# EAGLE schematic schematic_r2 (EAGLE 7.4.0)
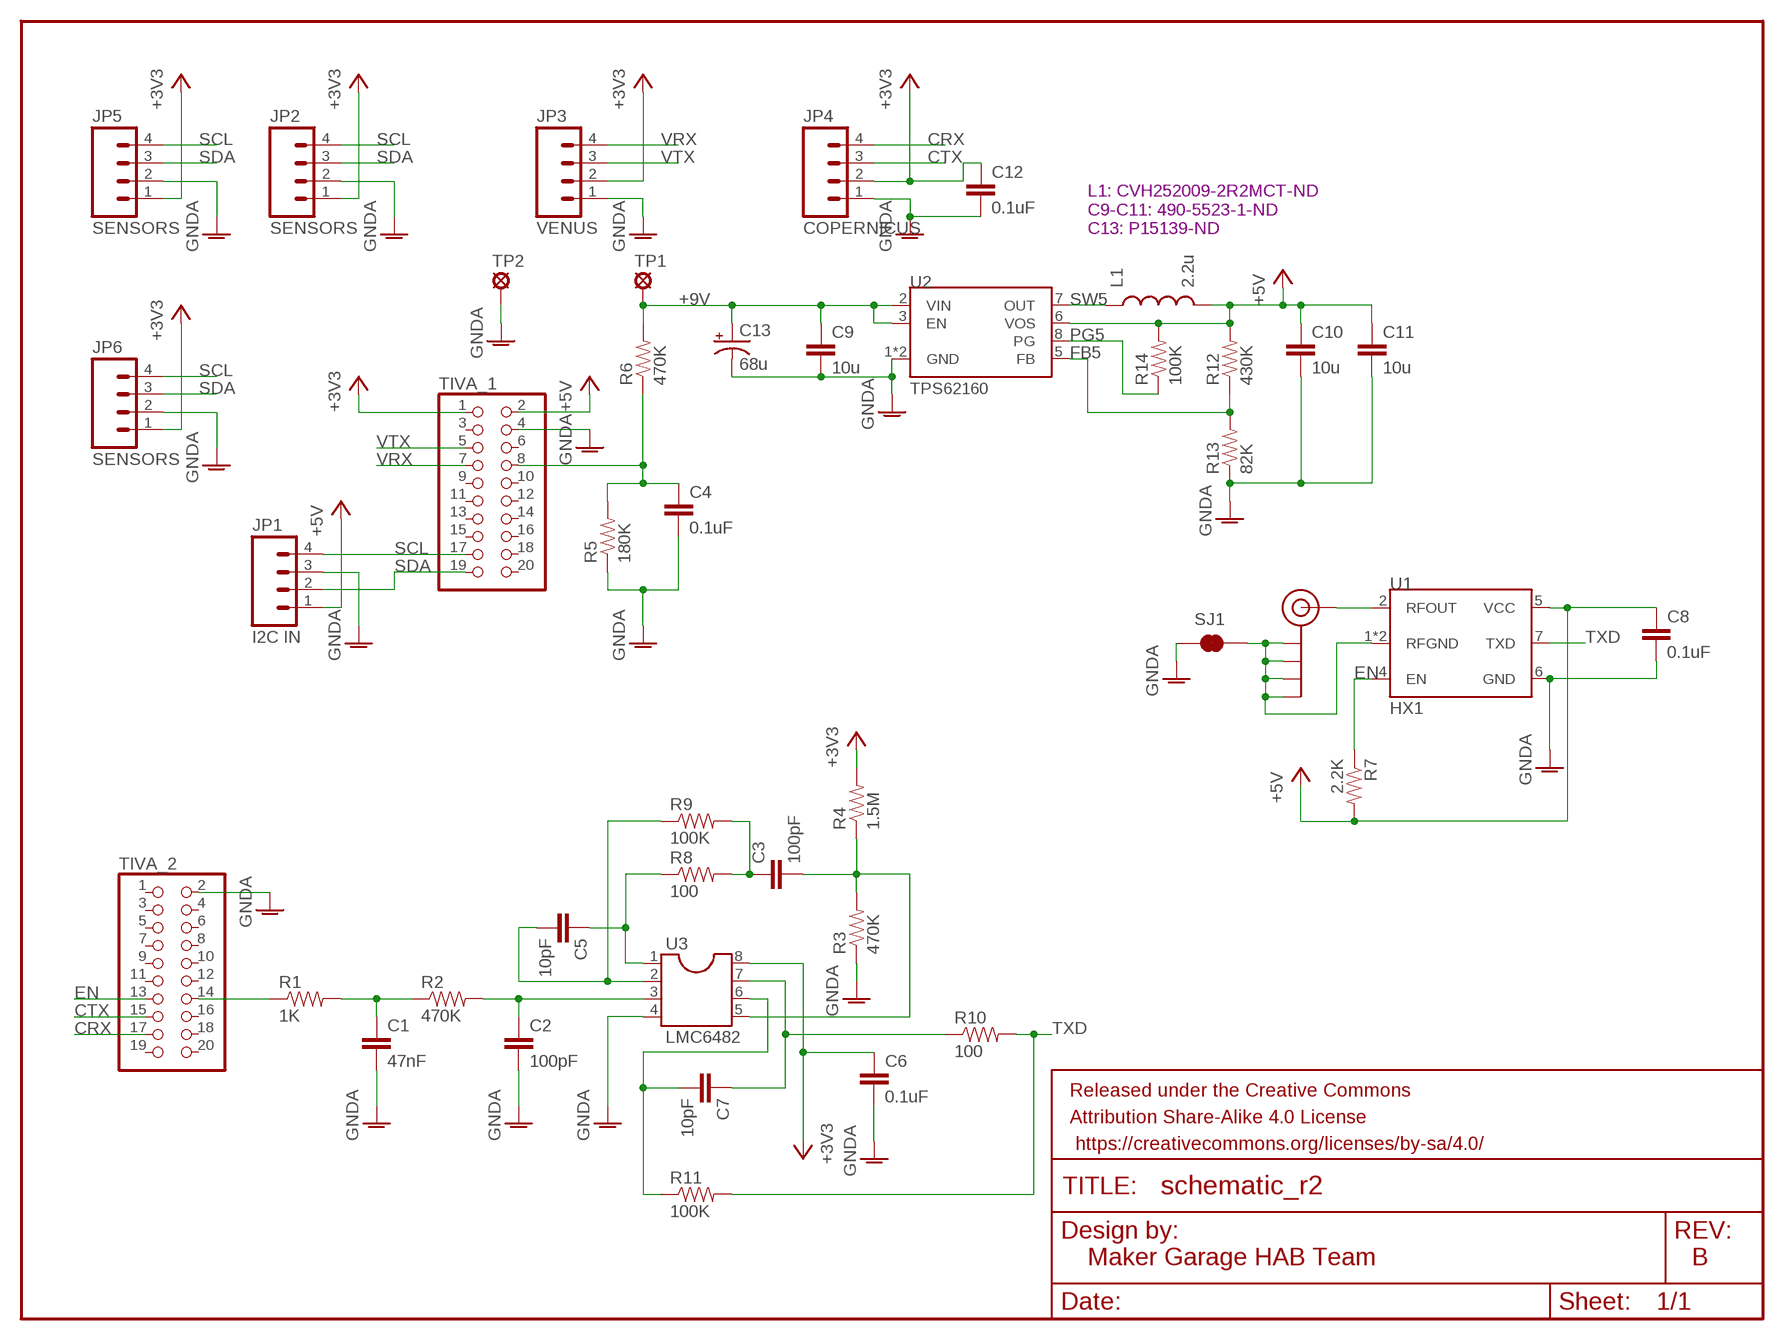
[diagram p0: schematic, sheet 1]

## Parts
C1  47nF  CAP0805  [0805]
C2  100pF  CAP0805  [0805]
C3  100pF  CAP0805  [0805]
C4  0.1uF  CAP0805  [0805]
C5  10pF  CAP0805  [0805]
C6  0.1uF  CAP0805  [0805]
C7  10pF  CAP0805  [0805]
C8  0.1uF  CAP0805  [0805]
C9  10u  CAP0805  [0805]
C10  10u  CAP0805  [0805]
C11  10u  CAP0805  [0805]
C12  0.1uF  CAP0805  [0805]
C13  68u  CAP_POLPTH2  [CPOL-RADIAL-10UF-25V]
FRAME1  FRAME-LETTERNO_PACKAGE  [DUMMY]
J1  SMA_EDGE  [SMA-EDGE]
JP1  I2C IN  M04PTH  [1X04]
JP2  SENSORS  M04PTH  [1X04]
JP3  VENUS  M04PTH  [1X04]
JP4  COPERNICUS  M04PTH  [1X04]
JP5  SENSORS  M04PTH  [1X04]
JP6  SENSORS  M04PTH  [1X04]
L1  2.2u  INDUCTOR1008  [1008]
R1  1K  RESISTOR0805-RES  [0805]
R2  470K  RESISTOR0805-RES  [0805]
R3  470K  RESISTOR0805-RES  [0805]
R4  1.5M  RESISTOR0805-RES  [0805]
R5  180K  RESISTOR0805-RES  [0805]
R6  470K  RESISTOR0805-RES  [0805]
R7  2.2K  RESISTOR0805-RES  [0805]
R8  100  RESISTOR0805-RES  [0805]
R9  100K  RESISTOR0805-RES  [0805]
R10  100  RESISTOR0805-RES  [0805]
R11  100K  RESISTOR0805-RES  [0805]
R12  430K  RESISTOR0805-RES  [0805]
R13  82K  RESISTOR0805-RES  [0805]
R14  100K  RESISTOR0805-RES  [0805]
SJ1  JUMPER-PAD-2-NC_BY_TRACE  [PAD-JUMPER-2-NC_BY_TRACE_YES_SILK]
TIVA_1  PINHD-2X10  [2X10]
TIVA_2  PINHD-2X10  [2X10]
TP1  MCS08  [MCS08]
TP2  MCS08  [MCS08]
U1  HX1  [1X12]
U2  TPS62160  [MSOP8]
U3  LMC6482  DIL8  [DIL08]

## Nets
+3V3: C6.1 C12.1 JP2.1 JP3.2 JP4.2 JP5.1 JP6.1 R4.2 TIVA_1.1 U3.8
+5V: C8.1 C10.1 C11.1 JP1.1 L1.2 R7.2 R12.2 R14.2 TIVA_1.2 U1.5(VCC) U2.6(VOS)
+9V: C9.1 C13.1(+) R6.2 TP1.MP U2.2(VIN) U2.3(EN)
CRX: JP4.4 TIVA_2.17
CTX: JP4.3 TIVA_2.15
EN: R7.1 TIVA_2.13 U1.4(EN)
FB5: R12.1 R13.2 U2.5(FB)
GNDA: C1.2 C2.2 C4.2 C6.2 C8.2 C9.2 C10.2 C11.2 C12.2 C13.2(-) JP1.3 JP2.2 JP3.1 JP4.1 JP5.2 JP6.2 R3.1 R5.1 R13.1 SJ1.1 TIVA_1.4 TIVA_2.2 TP2.MP U1.6(GND) U2.1(GND) U2.4(GND) U3.4
HPFB: C7.2 R11.1 U3.6
HPIN: C3.1 R8.2 R9.2
HPOUT: C3.2 R3.2 R4.1 U3.5
LPFB: C5.2 R9.1 U3.2
LPOUT: C5.1 R8.1 U3.1
PG5: R14.1 U2.8(PG)
PWMF1: C1.1 R1.2 R2.1
PWMF2: C2.1 R2.2 U3.3
PWMOUT: R1.1 TIVA_2.14
RFGND: J1.GND@0(GND) J1.GND@1(GND) J1.GND@2(GND) J1.GND@3(GND) SJ1.2 U1.1(RFGND) U1.3(RFGND)
RFOUT: J1.SIG(SIGNAL) U1.2(RFOUT)
SCL: JP1.4 JP2.4 JP5.4 JP6.4 TIVA_1.17
SDA: JP1.2 JP2.3 JP5.3 JP6.3 TIVA_1.19
SW5: L1.1 U2.7(OUT)
TXD: R10.2 R11.2 U1.7(TXD)
TXF: C7.1 R10.1 U3.7
VBAT: C4.1 R5.2 R6.1 TIVA_1.8
VRX: JP3.4 TIVA_1.7
VTX: JP3.3 TIVA_1.5
Unconnected: TIVA_1.3 TIVA_1.6 TIVA_1.9 TIVA_1.10 TIVA_1.11 TIVA_1.12 TIVA_1.13 TIVA_1.14 TIVA_1.15 TIVA_1.16 TIVA_1.18 TIVA_1.20 TIVA_2.1 TIVA_2.3 TIVA_2.4 TIVA_2.5 TIVA_2.6 TIVA_2.7 TIVA_2.8 TIVA_2.9 TIVA_2.10 TIVA_2.11 TIVA_2.12 TIVA_2.16 TIVA_2.18 TIVA_2.19 TIVA_2.20

## Notes on the sheet
- L1: CVH252009-2R2MCT-ND
  C9-C11: 490-5523-1-ND
  C13: P15139-ND
- Maker Garage HAB Team | B

## Library data of the parts
C1-C12 = SparkFun-Passives:CAP: Capacitor Standard 0603 ceramic capacitor, and 0.1" leaded capacitor.
C13 = SparkFun-Passives:CAP_POL: Capacitor Polarized These are standard SMD and PTH capacitors. Normally 10uF, 47uF, and 100uF in electrolytic and tantalum varieties. Always verify the external diameter of the through hole cap, it varies with capacity, voltage, and manufacturer. The EIA devices should be standard.
FRAME1 = SparkFun-Aesthetics:FRAME-LETTER: Schematic Frame Standard 8.5x11 US Letter frame; DESIGNER: Nobody; VERSION: v01
J1 = SparkFun-Connectors:SMA_EDGE: SMA Antenna Connector End launch SMA connector. The paste layer has been removed so that the connector can be hand soldered onto the board after reflow.
JP1-JP6 = SparkFun-Connectors:M04: Header 4 Standard 4-pin 0.1" header. Use with straight break away headers (SKU : PRT-00116), right angle break away headers (PRT-00553), swiss pins (PRT-00743), machine pins (PRT-00117), and female headers (PRT-00115). Molex polarized connector foot print use with SKU : PRT-08231 with associated crimp pins and housings. 1MM SMD Version SKU: PRT-10208
L1 = HAB:INDUCTOR: INDUCTOR Standard inductor, with some new packages Why do inductors never come in standard packages!?
R1-R14 = SparkFun-Passives:RESISTOR: Resistor Basic schematic elements and footprints for 0603, 1206, and PTH resistors.
SJ1 = SparkFun-Passives:JUMPER-PAD-2-NC_BY_TRACE
TIVA_1 TIVA_2 = pinhead:PINHD-2X10: PIN HEADER
TP1 TP2 = solpad:MCS08: SOLDER PAD MC S0,8, drill 1.2 mm, distributor Buerklin, 08F130
U1 = HAB:HX1: Radiometrix HX1 High-power VHF Narrow Band 300 mW Transmitter
U2 = HAB:TPS62160: TPS62160 Adjustable switch-mode D-CAP2 regulator
U3 = ic-package:DIL8: Dual In Line / Socket